# EAGLE schematic final proto schematic (EAGLE 9.3.2)
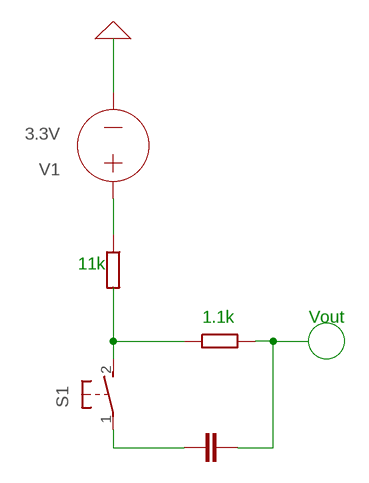
[diagram p0: schematic, sheet 1]

## Parts
S1  31-XX  [B3F-31XX]
V1  3.3V  VOLTAGE  (no package)

## Nets
0: V1.- ; supply symbol labelled GND
N$1: S1.2(S)
N$2: S1.1(P)
N$4: V1.+

## Notes on the sheet
- 11k
- 1.1k | Vout

## Library data of the parts
S1 = switch-omron:31-XX: OMRON SWITCH; MPN: B3F-3100; OC_FARNELL: 959704; OC_NEWARK: 36M3582
V1 = ngspice-simulation:VOLTAGE: Independent Voltage Source, either DC, AC, PULSE, SINE, PWL, EXP, or SFFM; VALUE: 0V